# Altium project RFM_Temperature_2.0.0.PrjPCB
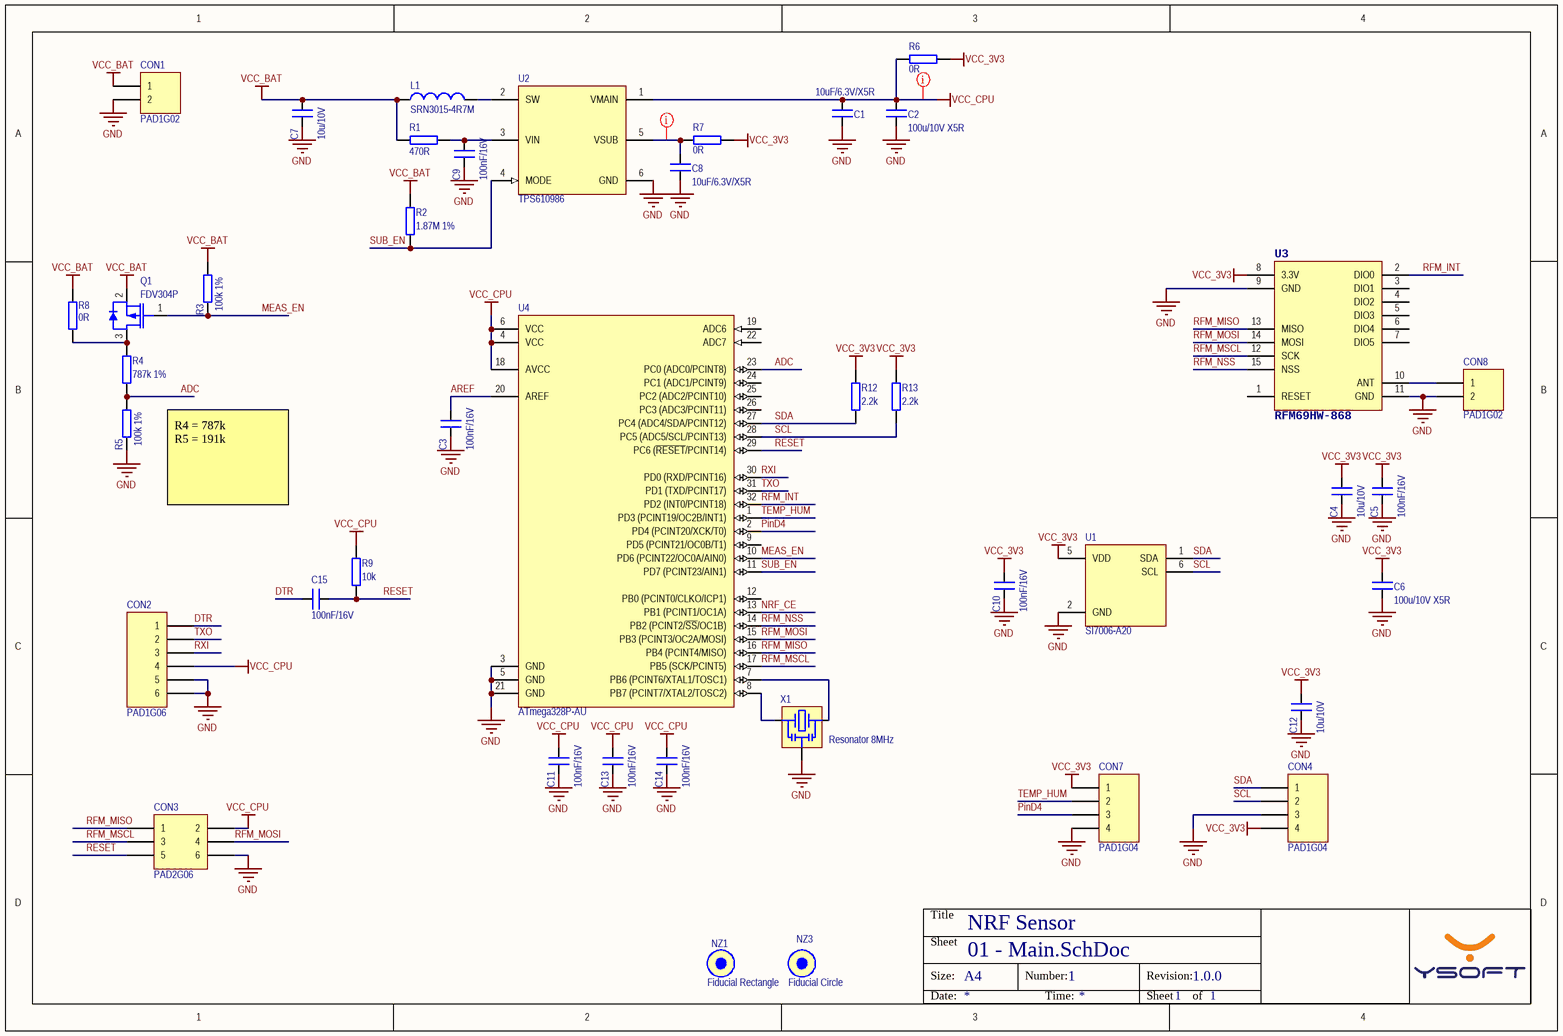
[diagram p0: 01 - Main.SchDoc]
Title: SafeQ; YSoftTitle: SafeQ
1 sheet, 41 parts. Net scope: global (net labels, ports and power ports of the same name join across sheets).
Board files: RFM_Temperature_2.0.0.PcbDoc, RFM_Temperature_2.0.0-panel.PcbDoc

## Sheet 01 - Main.SchDoc: NRF Sensor
size A4; DocumentNumber: 1; Revision: 1.0.0; SheetNumber: 1; SheetTotal: 1

### Parts
C1  10uF/6.3V/X5R  [C-0603]
C2  100u/10V X5R  [C-1206]
C3  100nF/16V  [C-0603]
C4  10u/10V  [C-0805]
C5  100nF/16V  [C-0603]
C6  100u/10V X5R  [C-1206]
C7  10u/10V  [C-0805]
C8  10uF/6.3V/X5R  [C-0603]
C9  100nF/16V  [C-0603]
C10  100nF/16V  [C-0603]
C11  100nF/16V  [C-0603]
C12  10u/10V  [C-0805]
C13  100nF/16V  [C-0603]
C14  100nF/16V  [C-0603]
C15  100nF/16V  [C-0603]
CON1  PAD1G02  [HDR1X02S]
CON2  PAD1G06  [HDR1X06S]
CON3  PAD2G06  [HDR2X06S]
CON4  PAD1G04  [HDR1X04S]
CON7  PAD1G04  [HDR1X04S]
CON8  PAD1G02  [HDR1X02S]
L1  SRN3015-4R7M  [TLU-SRN3015]
NZ1  Fiducial Rectangle  [Fiducial Rectangle]
NZ3  Fiducial Circle  [Fiducial Circle]
Q1  FDV304P  [SOT23-3L]
R1  470R  [R-0603]
R2  1.87M 1%  [R-0603]
R3  100k 1%  [R-0603]
R4  787k 1%  [R-0603]
R5  100k 1%  [R-0603]
R6  0R  [R-0603]
R7  0R  [R-0603]
R8  0R  [R-0603]
R9  10k  [R-0603]
R12  2.2k  [R-0603]
R13  2.2k  [R-0603]
U1  SI7006-A20  [DFN100P300X300X60_HS-7N - duplicate]
U2  TPS610986  [SON50P150X80-6N]
U3  RFM69HW-868  [RFM69HW-XXXS2]
U4  ATmega328P-AU  [TQFP80P900X900X120-32N]
X1  Resonator 8MHz  [Resonator]

### Nets
GND: C1.1 C2.1 C3.1 C4.1 C5.1 C6.1 C7.1 C8.1 C9.1 C10.1 C11.1 C12.1 C13.1 C14.1 CON1.2 CON2.5 CON2.6 CON3.6 CON4.3 CON7.4 CON8.2 R5.1 U1.2(GND) U2.6(GND) U3.9(GND) U3.11(GND) U4.3(GND) U4.5(GND) U4.21(GND) X1.2(GND)
VCC_3V3: C4.2 C5.2 C6.2 C10.2 C12.2 CON4.4 CON7.1 R6.1 R7.1 R12.2 R13.2 U1.5(VDD) U3.8(3.3V)
VCC_BAT: C7.2 CON1.1 L1.1 Q1.2(SOURCE) R1.1 R2.2 R3.2 R8.2
VCC_CPU: C1.2 C2.2 C11.2 C13.2 C14.2 CON2.4 CON3.2 R6.2 R9.2 U2.1(VMAIN) U4.4(VCC) U4.6(VCC) U4.18(AVCC)
ADC: R4.1 R5.2 U4.23(PC0_(ADC0/PCINT8))
AREF: C3.2 U4.20(AREF)
DTR: C15.2 CON2.1
MEAS_EN: Q1.1(GATE) R3.1 U4.10(PD6_(PCINT22/OC0A/AIN0))
NRF_CE: U4.13(PB1_(PCINT1/OC1A))
PinD4: CON7.3 U4.2(PD4_(PCINT20/XCK/T0))
RESET: C15.1 CON3.5 R9.1 U4.29(PC6_(~{RESET}/PCINT14))
RFM_INT: U3.2(DIO0) U4.32(PD2_(INT0/PCINT18))
RFM_MISO: CON3.1 U3.13(MISO) U4.16(PB4_(PCINT4/MISO))
RFM_MOSI: CON3.4 U3.14(MOSI) U4.15(PB3_(PCINT3/OC2A/MOSI))
RFM_MSCL: CON3.3 U3.12(SCK) U4.17(PB5_(SCK/PCINT5))
RFM_NSS: U3.15(NSS) U4.14(PB2_(PCINT2/~{SS}/OC1B))
RXI: CON2.3 U4.30(PD0_(RXD/PCINT16))
SCL: CON4.2 R13.1 U1.6(SCL) U4.28(PC5_(ADC5/SCL/PCINT13))
SDA: CON4.1 R12.1 U1.1(SDA) U4.27(PC4_(ADC4/SDA/PCINT12))
SUB_EN: R2.1 U2.4(MODE) U4.11(PD7_(PCINT23/AIN1))
TEMP_HUM: CON7.2 U4.1(PD3_(PCINT19/OC2B/INT1))
TXO: CON2.2 U4.31(PD1_(TXD/PCINT17))
NetC8_2: C8.2 R7.2 U2.5(VSUB)
NetC9_2: C9.2 R1.2 U2.3(VIN)
NetCON8_1: CON8.1 U3.10(ANT)
NetL1_2: L1.2 U2.2(SW)
NetQ1_3: Q1.3(DRAIN) R4.2 R8.1
NetU4_7: U4.7(PB6_(PCINT6/XTAL1/TOSC1)) X1.3(X2)
NetU4_8: U4.8(PB7_(PCINT7/XTAL2/TOSC2)) X1.1(X1)

Not connected (* = marked no-connect by the designer): U3 1(RESET) 3(DIO1) 4(DIO2) 5(DIO3) 6(DIO4) 7(DIO5); U4 9(PD5_(PCINT21/OC0B/T1)) 12(PB0_(PCINT0/CLKO/ICP1)) 19(ADC6) 22(ADC7) 24(PC1_(ADC1/PCINT9)) 25(PC2_(ADC2/PCINT10)) 26(PC3_(ADC3/PCINT11))

### Layout directives
net class Power Net: NetC8_2, VCC_CPU

### Notes on the sheet
- R4 = 787k
  R5 = 191k
- Title
- Size:
- Sheet
- A4
- Number:
- Revision:
- Date:
- Time:
- of

### Library data of the parts
C1 C8 = CMP-00255-2: SMD Ceramic Capacitor 0603 10uF/6.3V/X5R; Helios ID: CAP-0603 10uF/6.3V/X5R; Type: SMT; Package: 0603
C2 C6 = CMP-00294-5: SMD Ceramic Capacitor 1206 100u/10V X5R; Helios ID: CAP-1206 100u/10V X5R; Type: SMT; Package: 1206
C3 C5 C9-C11 C13-C15 = CMP-00250-2: SMD Ceramic Capacitor 0603 100nF/16V; Helios ID: CAP-0603 100nF/16V; Type: SMT; Package: 0603
C4 C7 C12 = CMP-00295-2: SMD Ceramic Capacitor 0805 10u/10V; Helios ID: CAP-0805 10u/10V; Type: SMT; Package: 0805
CON1 = CMP-00005-2: 1x2pin single row pads, 2.54mm; Helios ID: CON-PAD1G02; Type: TH
CON2 = CMP-00343-3: 1x6pin single row pads, 2.54mm; Helios ID: CON-PAD1G06; Type: TH
CON3 = CMP-00360-3: 2x3pin dual row pads, 2.54mm; Helios ID: CON-PAD2G06; Type: TH
CON4 CON7 = CMP-00006-4: 1x4pin single row pads, 2.54mm; Helios ID: CON-PAD1G04; Type: TH
CON8 = CMP-00005-1: 1x2pin single row pads, 2.54mm; Helios ID: KON-PAD1G02; LatestRevisionDate: 17-Jul-2002; LatestRevisionNote: Re-released for DXP Platform.; Publisher: Altium Limited; Type: TH
L1 = CMP-00463-1: Shielded inductor 4.7uH/1.2A 3x3mm; Type: SMT; Helios ID: IND-SRN3015-4R7M; HelpURL: http://www.bourns.com/docs/Product-Datasheets/SRN3015.pdf
NZ1 = CMP-00041-3: Helios ID: x004; Type: MECH
NZ3 = CMP-00042-4: Helios ID: x005; Type: MECH
Q1 = CMP-00186-2: P-Channel Digital FET 25V, 460mA; Helios ID: TRA-FDV304P; Type: SMT; Package: SOT23; HelpURL: http://www.fairchildsemi.com/ds/FD/FDV304P.pdf
R1 = CMP-00095-3: SMD Resistor 0603 470R; Value: 470; Helios ID: RES-0603 470R; Type: SMT; Package: 0603
R2 = CMP-00478-1: SMD Resistor 0603 1.87M 1%; Helios ID: RES-0603 1.87M 1%; Value: 1.87M; Type: SMT; Package: 0603
R3 R5 = CMP-00033-3: SMD Resistor 0603 100k 1%; Helios ID: RES-0603 100k 1%; Value: 100k; Type: SMT; Package: 0603
R4 = CMP-00126-4: SMD Resistor 0603 787k 1%; Helios ID: RES-0603 787k 1%; Value: 787k; Type: SMT; Package: 0603
R6-R8 = CMP-00032-4: SMD Resistor 0603 0R; Value: 0; Helios ID: RES-0603 0R; IFS PN: 100039; Type: SMT; Package: 0603
R9 = CMP-00036-4: SMD Resistor 0603 10k; Helios ID: RES-0603 10k; IFS PN: 100042; Value: 10k; Type: SMT; Package: 0603
R12 R13 = CMP-00080-3: SMD Resistor 0603 2k2; Helios ID: RES-0603 2k2; Value: 2.2k; Type: SMT; Package: 0603
U1 = CMP-00470-5: I2C Humidity and Temperature Sensor; Helios ID: IC-SI7006-A20-IM1; IFS PN: 100188; HelpURL: https://www.silabs.com/Support%20Documents/TechnicalDocs/Si7006-A20.pdf; Package: DFN6; Type: SMT
U2 = CMP-00462-2: Ultra-Low Quiescent Current Synchronous Boost with Integrated Load Switch; Helios ID: IC-TPS610986DSE; HelpURL: http://www.ti.com/lit/gpn/tps610986; Package: DSE6; Type: SMT
U3 = CMP-00469-4: RFM69HW ISM TRANSCEIVER MODULE; Helios ID: RF-RFM69HW-868S2; IFS PN: 100184; HelpURL: http://www.hoperf.com/upload/rf/RFM69HW-V1.3.pdf; Type: SMT
U4 = ATmega328P-AU: 8-bit AVR Microcontroller, 32KB Flash, 1KB EEPROM, 2KB SRAM, 32-pin TQFP, Industrial Grade (-40°C to 85°C); PackageDescription: 32-Lead, 7x7x1.0 mm Body, 0.8mm Lead Pitch, Thin Profile Plastic Quad Flat Package (TQFP); DatasheetVersion: revD, May-2011; RevisionNote: DatasheetVersion & PackageVersion updated. URLs added.; ComponentLink1URL: http://www.atmel.com/; ComponentLink2Description: ATmega48A/48PA/88A/88PA/168A/168PA/328/328P Datasheet; Code_JEDEC: MS-026-ABA; ComponentLink1Description: Manufacturer URL; PackageReference: 32A; ComponentLink3Description: ATmega48A/48PA/88A/88PA/168A/168PA/328/328P Summary; ComponentLink2URL: http://www.atmel.com/dyn/resources/prod_documents/doc8271.pdf; PackageVersion: revC, Oct-2010; ComponentLink3URL: http://www.atmel.com/dyn/resources/prod_documents/8271S.pdf

## Assembly variants
Prototype: not fitted CON1 CON2 CON3 CON4 CON7 CON8 Q1 R3 R7